# EAGLE design particle-can-v2.0 (EAGLE 7.5.0)
DATABASE: /home/monkbroc/eagle/PARTSDB.txt
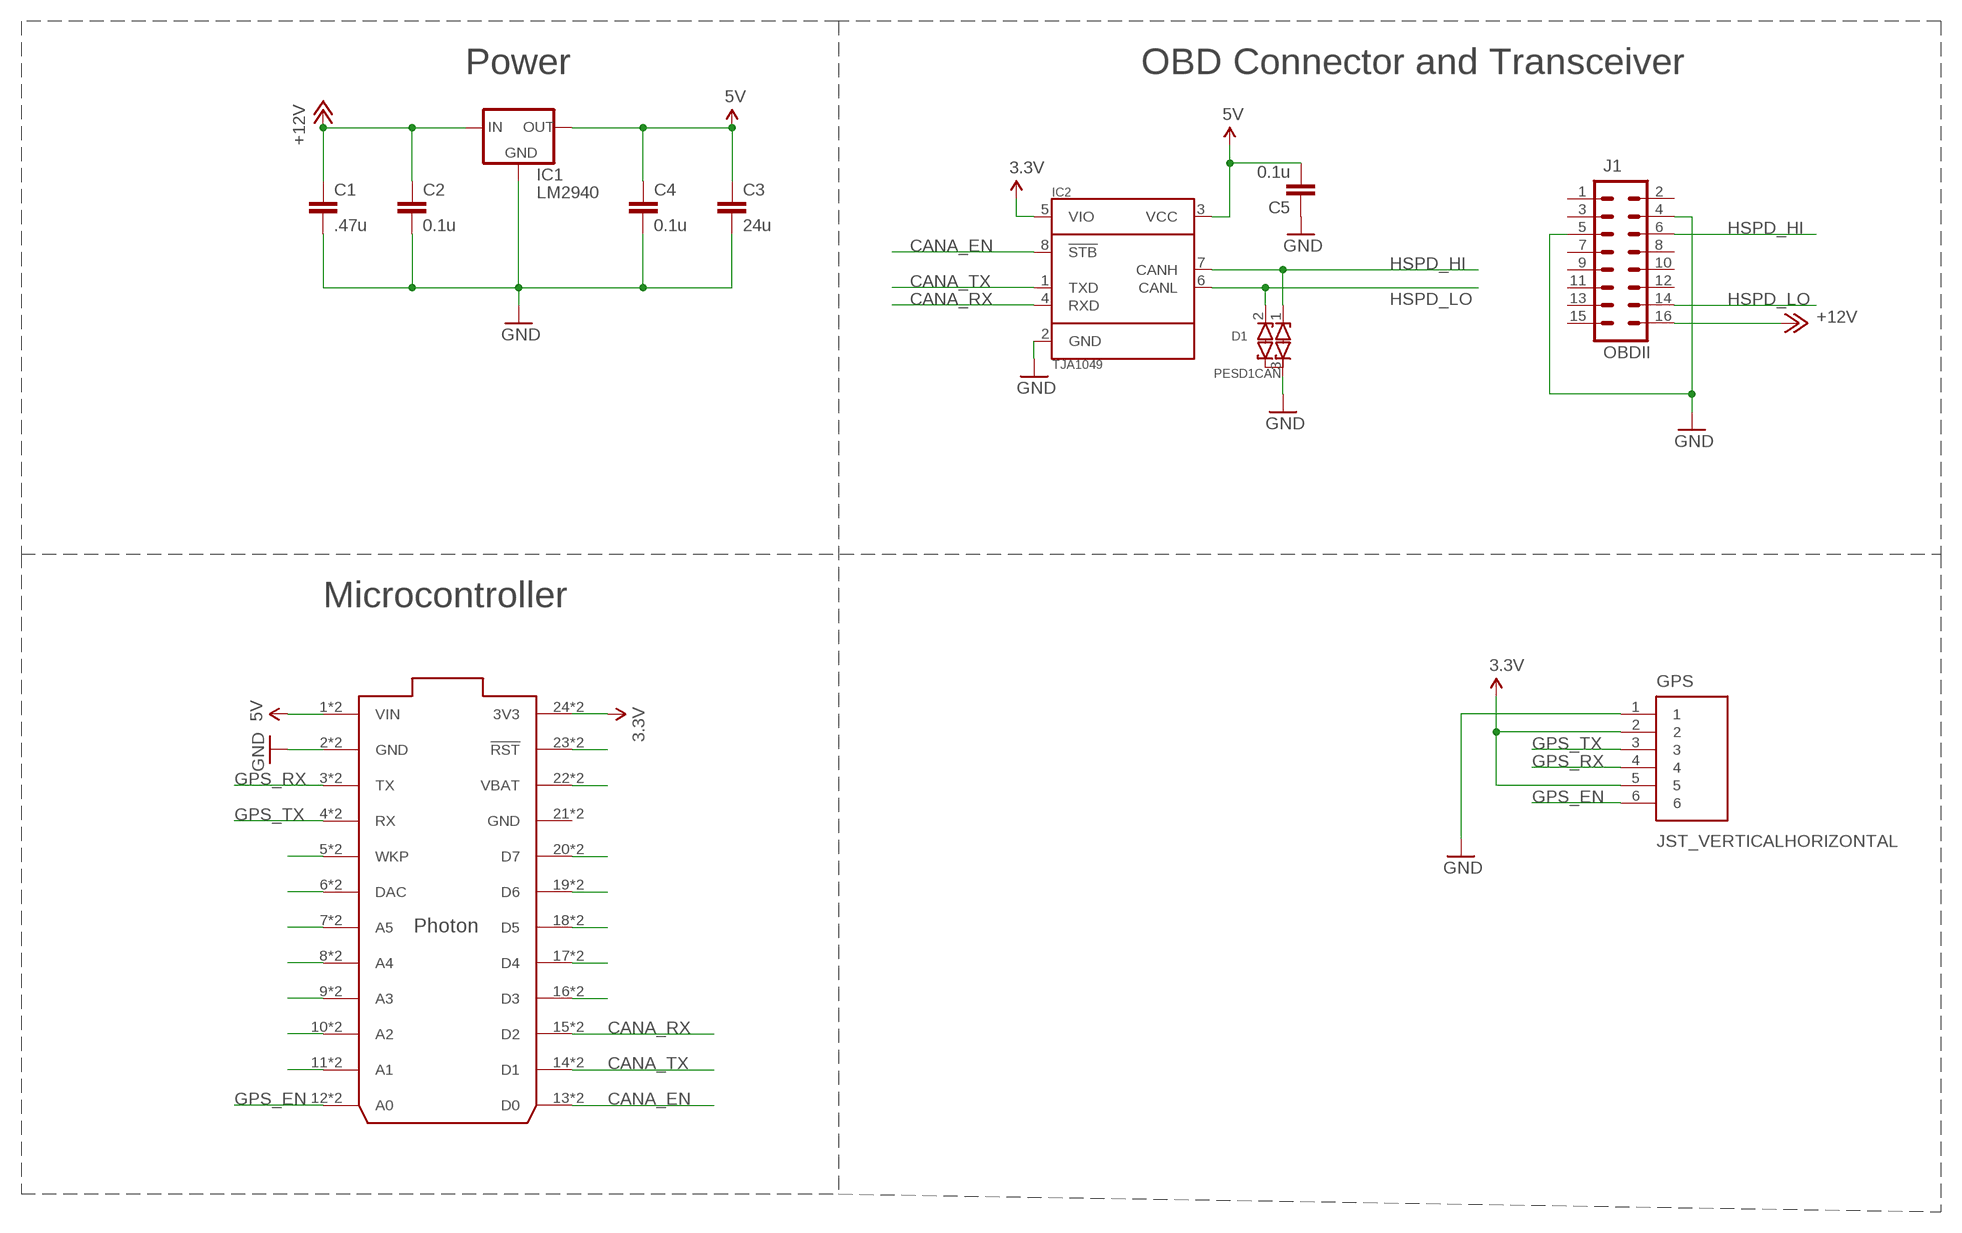
[diagram p0: schematic, sheet 1]

## Parts
C1  .47u  C-EUC0805  [C0805]
C2  0.1u  C-EUC0805  [C0805]
C3  24u  C-EUC0805  [C0805]
C4  0.1u  C-EUC0805  [C0805]
C5  0.1u  C-EUC0805  [C0805]
CORE  PHOTONWITH_EXTERNAL_HEADERS  [PHOTON_STACKABLE_EXTERNAL]
D1  PESD1CAN  DIODE_ESD_DUAL-SOT-23  [SOT23]
GPS  JST_VERTICALHORIZONTAL  [JST-6-SMD-HOR-1.0MM]
IC1  LM2940  [SOT223]
IC2  TJA1049  [SO8]
J1  OBDII  M08X2STRAIGHT  [OBDII-STRAIGHT]

## Nets
3.3V: CORE.24(3V3) CORE.@24(3V3) GPS.2 GPS.5 IC2.5(VIO)
5V: C3.1 C4.1 C5.2 CORE.1(VIN) CORE.@1(VIN) IC1.3(OUT) IC2.3(VCC)
+12V: C1.1 C2.1 IC1.1(IN) J1.16
CANA_EN: CORE.13(D0) CORE.@13(D0) IC2.8(!STB)
CANA_RX: CORE.15(D2) CORE.@15(D2) IC2.4(RXD)
CANA_TX: CORE.14(D1) CORE.@14(D1) IC2.1(TXD)
GND: C1.2 C2.2 C3.2 C4.2 C5.1 CORE.2(GND) CORE.@2(GND) D1.3(COM) GPS.1 IC1.2(GND) IC1.4(GND) IC2.2(GND) J1.4 J1.5
GPS_EN: CORE.12(A0) CORE.@12(A0) GPS.6
GPS_RX: CORE.3(TX) CORE.@3(TX) GPS.4
GPS_TX: CORE.4(RX) CORE.@4(RX) GPS.3
HSPD_HI: D1.1(C1) IC2.7(CANH) J1.6
HSPD_LO: D1.2(C2) IC2.6(CANL) J1.14
N$10: CORE.23(!RST) CORE.@23(!RST)
N$11: CORE.22(VBAT) CORE.@22(VBAT)
N$12: CORE.20(D7) CORE.@20(D7)
N$13: CORE.19(D6) CORE.@19(D6)
N$14: CORE.18(D5) CORE.@18(D5)
N$15: CORE.17(D4) CORE.@17(D4)
N$16: CORE.16(D3) CORE.@16(D3)
N$18: CORE.11(A1) CORE.@11(A1)
N$19: CORE.10(A2) CORE.@10(A2)
N$20: CORE.9(A3) CORE.@9(A3)
N$23: CORE.8(A4) CORE.@8(A4)
N$24: CORE.7(A5) CORE.@7(A5)
N$25: CORE.6(DAC) CORE.@6(DAC)
N$26: CORE.5(WKP) CORE.@5(WKP)
Unconnected: J1.1 J1.2 J1.3 J1.7 J1.8 J1.9 J1.10 J1.11 J1.12 J1.13 J1.15

## Notes on the sheet
- Power | OBD Connector and Transceiver
- Microcontroller

## Power pins joined to a net without a drawn wire
GND: CORE.21(GND) CORE.@21(GND)

## Library data of the parts
C1 C2 = rcl:C-EU: CAPACITOR, European symbol; PARTNO: 06035A101JAT2A
C3 C4 = rcl:C-EU: CAPACITOR, European symbol; PARTNO: CC0805KKX7R9BB474
C5 = rcl:C-EU: CAPACITOR, European symbol; PARTNO: CC0603JRX7R7BB104
CORE = Particle:PHOTON; PARTNO: PPPC122LFBN-RC
D1 = BUG:DIODE_ESD_DUAL: Dual ESD Diode, with a common anode; PARTNO: PESD1CAN,215
GPS = SparkFun-Connectors:JST_VERTICAL
IC1 = BUG:LM2940
IC2 = BUG:TJA1049
J1 = BUG:M08X2: .1" headers, two rows of 8 each; PARTNO: OBD-II

## Board
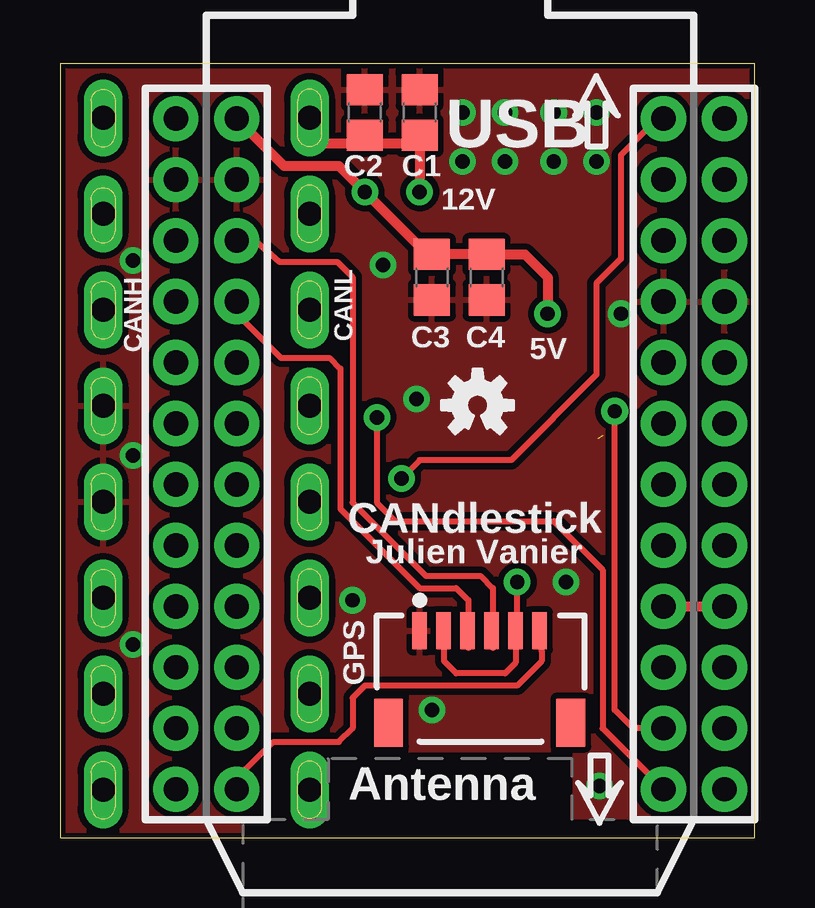
[diagram p1: board, top side]
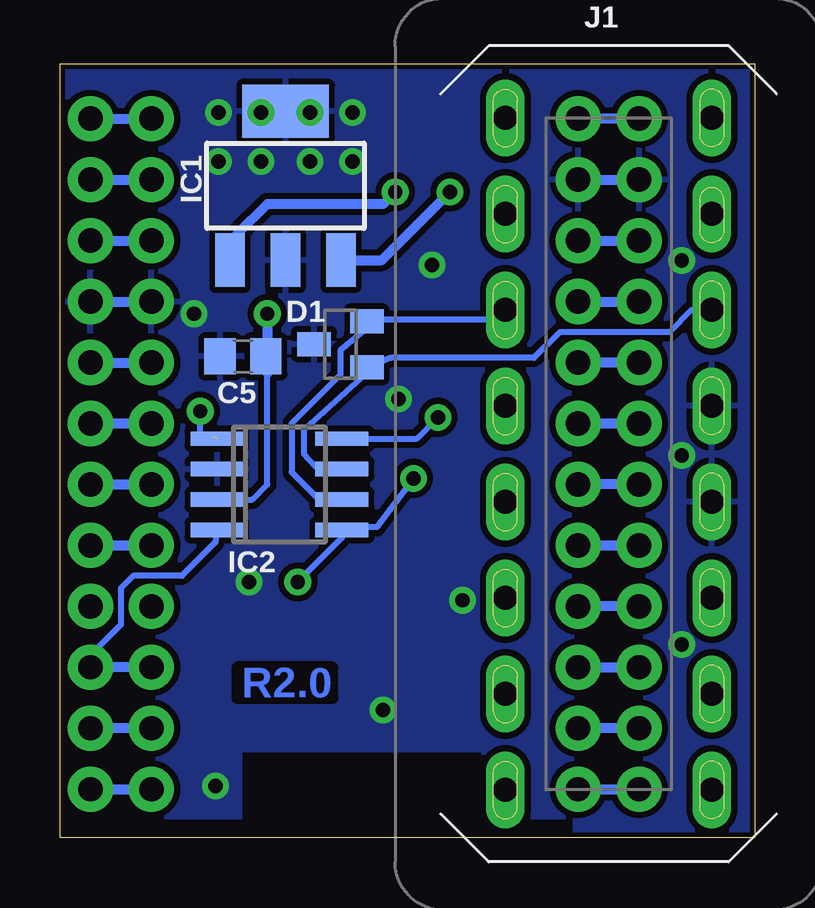
[diagram p2: board, bottom side, seen from below]

Size 28.96 x 32.26 mm. Coordinates in mm from the lower left corner, seen from the top.
Outline: 0,0 28.96,0 28.96,32.26 0,32.26 0,0
Copper layers (1*16): Top 0.035mm / dielectric 1.5mm / Bottom 0.035mm
Design rules "SparkFun *": minimum track width 8mil, minimum drill 20mil, track to track 10mil, track to pad 8mil, pad to pad 10mil, via to via 10mil, smd to smd 10mil, copper to edge 8mil, drill to drill 8mil, minimum pad ring 12mil, minimum via ring 10mil, stop-mask expansion 4mil, vias tented up to drill 45mil, thermal gap 10mil
tRestrict: area 33.3,7.6 to 46,20.3; area 11.2,0.8 to 21.3,3.6; area 7.6,-0.8 to 24.9,0.8
bRestrict: area 11.4,0.8 to 21.3,3.6; area 7.6,-0.8 to 24.9,0.8

### Footprints (pad centres in the part's own frame; a part is rotated, then mirrored left to right if it is on the bottom)
C0805 = smd 1.3 x 1.5: 1 -0.95,0; 2 0.95,0
PHOTON_STACKABLE_EXTERNAL = drill 1.016 pad 1.88: 1 1.27,32.258; 2 1.27,29.718; 3 1.27,27.178; 4 1.27,24.638; 5 1.27,22.098; 6 1.27,19.558; 7 1.27,17.018; 8 1.27,14.478; 9 1.27,11.938; 10 1.27,9.398; 11 1.27,6.858; 12 1.27,4.318; 13 19.05,4.318; 14 19.05,6.858; 15 19.05,9.398; 16 19.05,11.938; 17 19.05,14.478; 18 19.05,17.018; 19 19.05,19.558; 20 19.05,22.098; 21 19.05,24.638; 22 19.05,27.178; 23 19.05,29.718; 24 19.05,32.258; @1 -1.27,32.258; @2 -1.27,29.718; @3 -1.27,27.178; @4 -1.27,24.638; @5 -1.27,22.098; @6 -1.27,19.558; @7 -1.27,17.018; @8 -1.27,14.478; @9 -1.27,11.938; @10 -1.27,9.398; @11 -1.27,6.858; @12 -1.27,4.318; @13 21.59,4.318; @14 21.59,6.858; @15 21.59,9.398; @16 21.59,11.938; @17 21.59,14.478; @18 21.59,17.018; @19 21.59,19.558; @20 21.59,22.098; @21 21.59,24.638; @22 21.59,27.178; @23 21.59,29.718; @24 21.59,32.258
SOT23 = smd 1 x 1.4: 1 -0.95,-1.1; 2 0.95,-1.1; 3 0,1.1
JST-6-SMD-HOR-1.0MM = smd 0.6 x 1.55: 1 -2.54,1.27; 2 -1.54,1.27; 3 -0.54,1.27; 4 0.46,1.27; 5 1.46,1.27; 6 2.46,1.27 | smd 1.2 x 2: P$1 -3.84,-2.555; P$2 3.76,-2.555
SOT223 = smd 1.219 x 2.235: 1 -2.311,-3.099; 2 0,-3.099; 3 2.311,-3.099 | smd 3.6 x 2.2: 4 0,3.099
SO8 = smd 0.6 x 2.2: 1 -1.905,-2.6; 2 -0.635,-2.6; 3 0.635,-2.6; 4 1.905,-2.6; 5 1.905,2.6; 6 0.635,2.6; 7 -0.635,2.6; 8 -1.905,2.6
OBDII-STRAIGHT = drill 1 pad 1.5 long: 1 14,4.3; 2 10,4.3; 3 6,4.3; 4 2,4.3; 5 -2,4.3; 6 -6,4.3; 7 -10,4.3; 8 -14,4.3; 9 14,-4.3; 10 10,-4.3; 11 6,-4.3; 12 2,-4.3; 13 -2,-4.3; 14 -6,-4.3; 15 -10,-4.3; 16 -14,-4.3

### Placement (x,y rotation side)
C1  14.99,30.23 90 top
C2  12.7,30.23 90 top
C3  15.49,23.37 270 top
C4  17.78,23.37 270 top
C5  21.34,20.07 0 bottom
CORE  6.1,-2.29 0 top
D1  17.27,20.57 90 bottom
F2  [OSHW-LOGO-S]  17.4,18.03 0 top
GPS  17.53,7.37 0 top
IC1  19.56,27.18 0 bottom
IC2  19.81,14.73 270 bottom
J1  6.1,16 270 bottom
ZDRAW1  [A4L-LOC]  37.59,19.69 0 top  (outside the outline)

### Tracks (layer width: path | path; a pad name or v marks a point on that pad's centre or on a via)
3.3V  (via drill 0.6)
  Top 0.254: CORE.24 24.89,29.97 23.37,28.45 23.37,24.13 22.35,23.11 22.35,19.3 18.8,15.75 14.99,15.75 v14.22,14.99 | GPS.2 16,7.86 16,7.37 16.51,6.86 18.54,6.86 18.99,7.3 GPS.5 19.05,7.94 v19.05,10.67
  Bottom 0.254: v14.22,14.99 15.75,12.95 17.27,12.95 17.27,12.89 IC2.5 17.21,12.51 v19.05,10.67
  Bottom 0.406: CORE.@24 CORE.24
5V  (via drill 0.6)
  Top 0.406: CORE.1 9.33,28.01 11.62,28.01 v12.7,26.92 15.24,24.38 15.31,24.45 15.31,24.57 C3.1 | 15.43,24.38 C3.1 | C3.1 C4.1 19.37,24.32 20.32,23.37 v20.32,21.84
  Bottom 0.254: IC2.3 20.95,14.1 20.32,14.73 20.32,19.24 C5.2
  Bottom 0.406: CORE.@1 CORE.1 | IC1.3 15.54,24.08 v12.7,26.92 | v20.32,21.84 20.32,19.37 C5.2
+12V  (via drill 0.6)
  Top 0.406: J1.16 9.89,29.74 10.67,28.96 12.51,28.96 C2.1 12.7,28.96 14.99,28.96 C1.1 v14.99,26.92
  Bottom 0.406: IC1.1 21.59,24.31 21.59,25.15 20.32,26.42 15.49,26.42 v14.99,26.92
CANA_EN  (via drill 0.6)
  Top 0.254: v13.21,17.53 13.21,13.97 13.97,13.21 20.57,13.21 22.61,11.18 22.61,4.57 CORE.13
  Bottom 0.254: IC2.8 14.1,16.64 v13.21,17.53
  Bottom 0.406: CORE.@13 CORE.13
CANA_RX
  Bottom 0.254: IC2.4 22.48,12.32 23.88,10.92 25.91,10.92 26.42,10.41 26.42,8.89 27.69,7.62 CORE.@15
  Bottom 0.406: CORE.15 CORE.@15
CANA_TX  (via drill 0.6)  (1 unrouted)
  Top 0.254: CORE.14 23.88,4.57 23.11,5.33 v23.11,17.78
  Bottom 0.254: 22.61,16.76 23.11,16.76 v23.11,17.78
  Bottom 0.406: CORE.14 CORE.@14
GND  (via drill 0.6)
  Bottom 0.406: CORE.@21 CORE.21 | CORE.2 CORE.@2
  other vias: 22.35,30.23 18.54,30.23 16.76,30.23 16.76,28.19 18.54,28.19 20.57,28.19 22.35,28.19 20.57,30.23 13.46,23.88 12.19,9.91 15.49,5.33 21.08,10.67 3.05,24.07 3.05,15.94 3.05,8.06 14.86,18.29 23.37,21.84 22.48,2.16
  pour Top (rank 4): 0,0 28.96,0 28.96,32.26 0,32.26
  pour Bottom: 0,0 28.96,0 28.96,32.26 0,32.26
GPS_EN
  Top 0.254: CORE.12 7.37,2.54 8.89,4 11.62,4 12.19,4.57 12.19,5.84 12.7,6.35 19.05,6.35 20.07,7.37 20.07,7.79 GPS.6
  Bottom 0.406: CORE.12 CORE.@12
GPS_RX
  Top 0.254: CORE.3 8.13,24.89 9.14,24 11.56,24 12.19,23.37 12.19,13.97 15.24,10.92 17.53,10.92 18.03,10.41 18.03,7.92 GPS.4
  Bottom 0.406: CORE.3 CORE.@3
GPS_TX
  Top 0.254: CORE.4 7.37,21.84 9.21,20 11.24,20 11.68,19.56 11.68,13.72 14.99,10.41 16.51,10.41 17.02,9.91 17.02,7.91 GPS.3
  Bottom 0.406: CORE.4 CORE.@4
HSPD_HI
  Bottom 0.254: J1.6 2.64,22 3.56,21.08 8.13,21.08 9.21,20 15.16,20 D1.1 16.19,19.37 18.8,17.02 18.8,16 18.1,15.24 IC2.7
HSPD_LO
  Bottom 0.254: J1.14 9.89,21.86 10.16,21.59 15.6,21.59 D1.2 15.81,21.52 17.27,20.32 17.27,19.3 19.3,17.27 19.3,15.24 18.03,13.97 17.34,13.97 IC2.6
N$10
  Bottom 0.406: CORE.@23 CORE.23
N$11
  Bottom 0.406: CORE.@22 CORE.22
N$12
  Bottom 0.406: CORE.@20 CORE.20
N$13
  Bottom 0.406: CORE.@19 CORE.19
N$14
  Bottom 0.406: CORE.@18 CORE.18
N$15
  Bottom 0.406: CORE.@17 CORE.17
N$16
  Top 0.406: CORE.16 CORE.@16
N$18
  Bottom 0.406: CORE.@11 CORE.11
N$19
  Bottom 0.406: CORE.10 CORE.@10
N$20
  Bottom 0.406: CORE.@9 CORE.9
N$23
  Bottom 0.406: CORE.8 CORE.@8
N$24
  Bottom 0.406: CORE.@7 CORE.7
N$25
  Bottom 0.406: CORE.6 CORE.@6
N$26
  Bottom 0.406: CORE.@5 CORE.5

### Text on the board
Bottom: R2.0
tPlace: USB | 12V | CANH | CANL | 5V | CANdlestick | Julien Vanier | Antenna
Document: NOTES: | Revision 2.0 | Julien Vanier | jvanier@gmail.com